# EAGLE design Wireless Flex Node SMD (EAGLE 7.5.0)
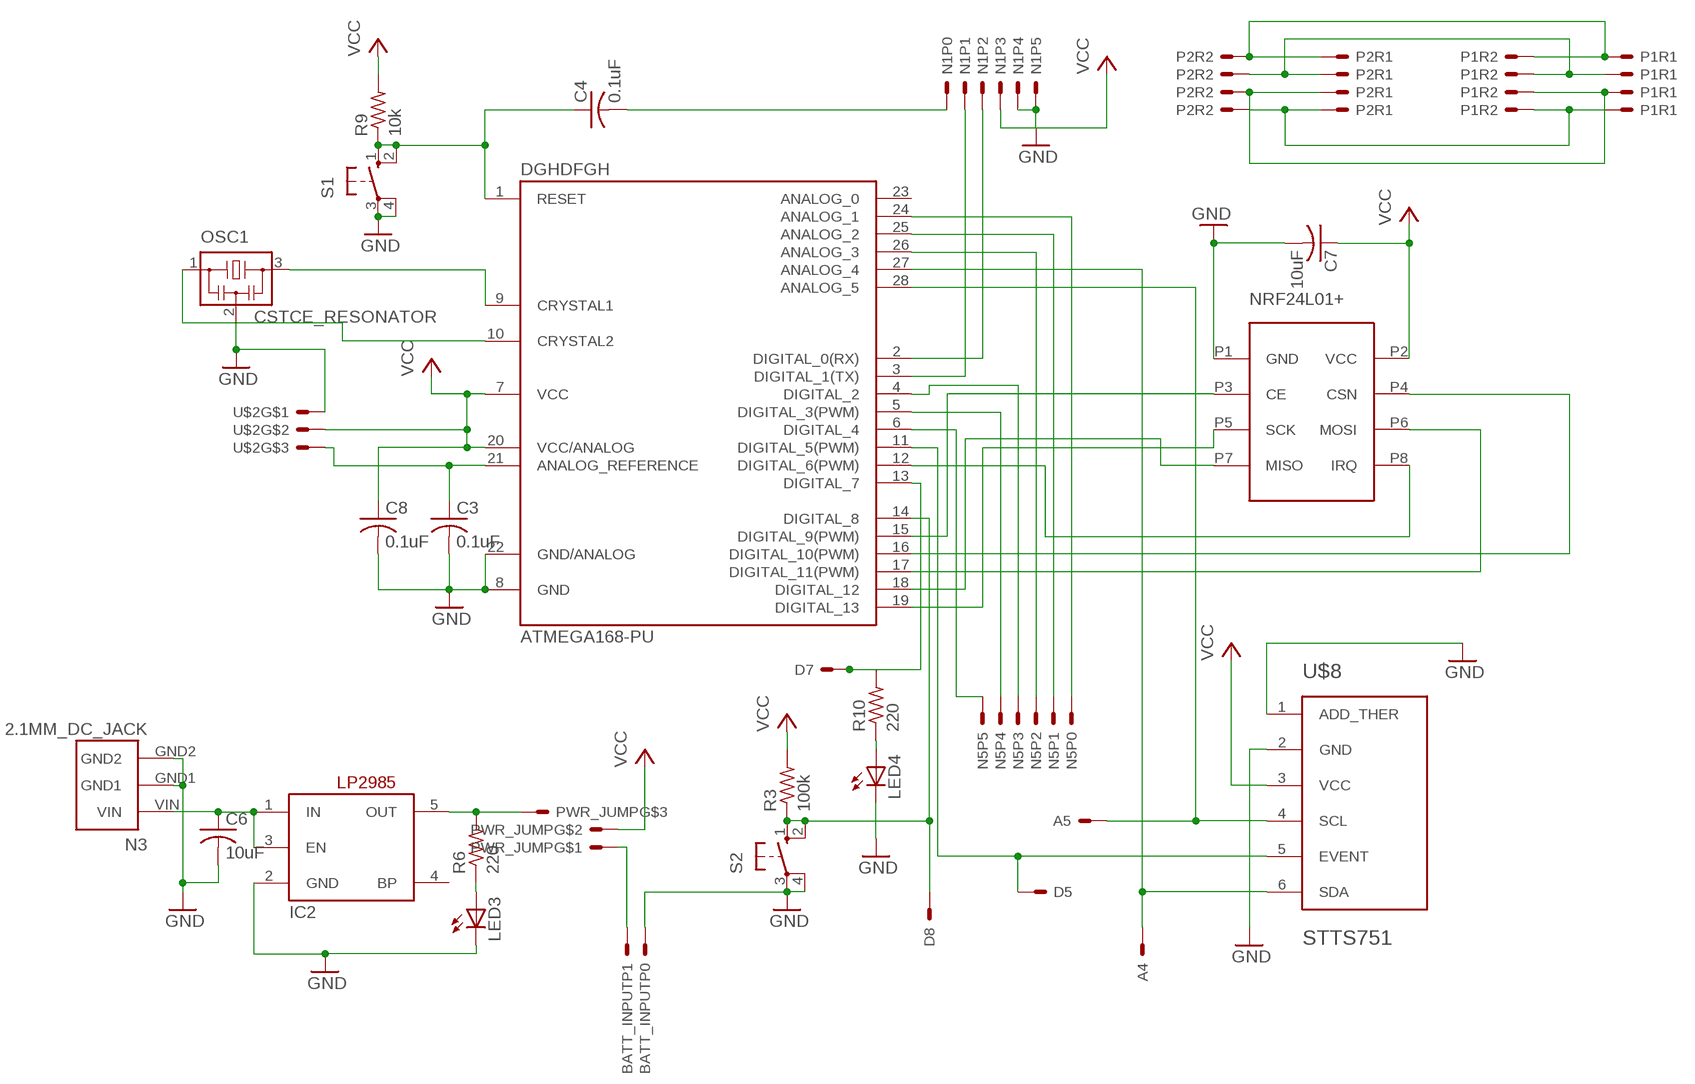
[diagram p0: schematic, sheet 1]

## Parts
A4  1PINHEADER_S  [1PINHEADER_S]
A5  1PINHEADER_S  [1PINHEADER_S]
BATT_INPUT  2PINHEADER  [2PINHEADER]
C3  0.1uF  C-USC1206  [C1206]
C4  0.1uF  C-USC1206  [C1206]
C6  10uF  C-USC1206  [C1206]
C7  10uF  C-USC1206  [C1206]
C8  0.1uF  C-USC1206  [C1206]
D5  1PINHEADER_S  [1PINHEADER_S]
D7  1PINHEADER_S  [1PINHEADER_S]
D8  1PINHEADER_S  [1PINHEADER_S]
DGHDFGH  ATMEGA168-PU  [DIL28-3]
IC2  LP2985  [SOT23]
LED3  LEDSMT1206  [1206]
LED4  LEDSMT1206  [1206]
N1  6PINHEADER  [6PINHEADER]
N3  2.1MM_DC_JACK  [2.1MM_DC_JACK]
N5  6PINHEADER  [6PINHEADER]
NRF24L01+  NRF24L01A  [NRF24L01]
OSC1  CSTCE_RESONATOR  [CSTCE_RESONATOR]
P1  2X4_HEADER  [2X4_HEADER]
P2  2X4_HEADER  [2X4_HEADER]
PWR_JUMP  3PINHEADER  [3PINHEADER]
R3  100k  R-US_R1206  [R1206]
R6  220  R-US_R1206  [R1206]
R9  10k  R-US_R1206  [R1206]
R10  220  R-US_R1206  [R1206]
S1  10-XX  [B3F-10XX]
S2  10-XX  [B3F-10XX]
U$2  3PINHEADER  [3PINHEADER]
U$8  STTS751  [STTS751-SOT23-6L]

## Nets
A5: D5.P$1(S) DGHDFGH.11(DIGITAL_5(PWM)) U$8.5(EVENT)
GND: BATT_INPUT.P0 C3.2 C6.2 C7.2 C8.2 DGHDFGH.8(GND) DGHDFGH.22(GND/ANALOG) IC2.2(GND) LED3.C LED4.C N1.P4 N1.P5 N3.GND1 N3.GND2 NRF24L01+.P1(GND) OSC1.2 S1.3(P) S1.4(P1) S2.3(P) S2.4(P1) U$2.N0 U$8.1(ADD_THER) U$8.2(GND)
N$1: DGHDFGH.10(CRYSTAL2) OSC1.1
N$2: DGHDFGH.18(DIGITAL_12) NRF24L01+.P7(MISO)
N$3: DGHDFGH.19(DIGITAL_13) NRF24L01+.P5(SCK)
N$5: DGHDFGH.17(DIGITAL_11(PWM)) NRF24L01+.P6(MOSI)
N$9: DGHDFGH.16(DIGITAL_10(PWM)) NRF24L01+.P4(CSN)
N$10: DGHDFGH.15(DIGITAL_9(PWM)) NRF24L01+.P3(CE)
N$11: D7.P$1(S) DGHDFGH.13(DIGITAL_7) R10.2
N$12: C4.2 N1.P0
N$13: DGHDFGH.9(CRYSTAL1) OSC1.3
N$15: C4.1 DGHDFGH.1(RESET) R9.1 S1.1(S) S1.2(S1)
N$16: D8.P$1(S) DGHDFGH.14(DIGITAL_8) R3.1 S2.1(S) S2.2(S1)
N$17: LED4.A R10.1
N$19: DGHDFGH.3(DIGITAL_1(TX)) N1.P1
N$20: DGHDFGH.2(DIGITAL_0(RX)) N1.P2
N$21: C3.1 DGHDFGH.21(ANALOG_REFERENCE) U$2.N2
N$22: DGHDFGH.12(DIGITAL_6(PWM)) NRF24L01+.P8(IRQ)
N$23: DGHDFGH.6(DIGITAL_4) N5.P5
N$25: DGHDFGH.5(DIGITAL_3(PWM)) N5.P4
N$26: A5.P$1(S) DGHDFGH.28(ANALOG_5) U$8.4(SCL)
N$28: A4.P$1(S) DGHDFGH.27(ANALOG_4) U$8.6(SDA)
N$32: C6.1 IC2.1(IN) IC2.3(EN) N3.VIN
N$34: IC2.5(OUT) PWR_JUMP.N2 R6.2
N$35: BATT_INPUT.P1 PWR_JUMP.N0
N$36: LED3.A R6.1
N$37: DGHDFGH.4(DIGITAL_2) N5.P3
N$38: DGHDFGH.26(ANALOG_3) N5.P2
N$39: DGHDFGH.25(ANALOG_2) N5.P1
N$40: DGHDFGH.24(ANALOG_1) N5.P0
N$88: P1.P1(R1:S) P1.P5(R2:S) P2.P1(R1:S) P2.P5(R2:S)
N$89: P1.P2(R1:S1) P1.P6(R2:S1) P2.P2(R1:S1) P2.P6(R2:S1)
N$90: P1.P3(R1:S2) P1.P7(R2:S2) P2.P3(R1:S2) P2.P7(R2:S2)
N$91: P1.P4(R1:S3) P1.P8(R2:S3) P2.P4(R1:S3) P2.P8(R2:S3)
VCC: C7.1 C8.1 DGHDFGH.7(VCC) DGHDFGH.20(VCC/ANALOG) N1.P3 NRF24L01+.P2(VCC) PWR_JUMP.N1 R3.2 R9.2 U$2.N1 U$8.3(VCC)
Unconnected: DGHDFGH.23(ANALOG_0) IC2.4(BP)

## Library data of the parts
A4 A5 D5 D7 D8 = ForceTronics:1PINHEADER_S: 1 pin header with round pad
BATT_INPUT = ForceTronics:2PINHEADER
C3 C4 C6-C8 = rcl:C-US: CAPACITOR, American symbol
DGHDFGH = Arduino-AVR:ATMEGA168-PU
IC2 = ForceTronics:LP2985: LP2985 Linear regulator from TI. Comes in various voltage levels. Low dropout and max current is 150mA
LED3 LED4 = adafruit:LED: LED OSRAM: - CHIPLED LG R971, LG N971, LY N971, LG Q971, LY Q971, LO R971, LY R971 LH N974, LH R974 LS Q976, LO Q976, LY Q976 LO Q996 - Hyper CHIPLED LW Q18S LB Q993, LB Q99A, LB R99A - SideLED LS A670, LO A670, LY A670, LG A670, LP A670 LB A673, LV A673, LT A673, LW A673 LH A674 LY A675 LS A676, LA A676, LO A676, LY A676, LW A676 LS A679, LY A679, LG A679 - Hyper Micro SIDELEDÂ® LS Y876, LA Y876, LO Y876, LY Y876 LT Y87S - SmartLED LW L88C, LW L88S LB L89C, LB L89S, LG L890 LS L89K, LO L89K, LY L89K LS L896, LA L896, LO L896, LY L896 - TOPLED LS T670, LO T670, LY T670, LG T670, LP T670 LSG T670, LSP T670, LSY T670, LOP T670, LYG T670 LG T671, LOG T671, LSG T671 LB T673, LV T673, LT T673, LW T673 LH T674 LS T676, LA T676, LO T676, LY T676, LB T676, LH T676, LSB T676, LW T676 LB T67C, LV T67C, LT T67C, LS T67K, LO T67K, LY T67K, LW E67C LS E67B, LA E67B, LO E67B, LY E67B, LB E67C, LV E67C, LT E67C LW T67C LS T679, LY T679, LG T679 LS T770, LO T770, LY T770, LG T770, LP T770 LB T773, LV T773, LT T773, LW T773 LH T774 LS E675, LA E675, LY E675, LS T675 LS T776, LA T776, LO T776, LY T776, LB T776 LHGB T686 LT T68C, LB T68C - Hyper Mini TOPLEDÂ® LB M676 - Mini TOPLED SantanaÂ® LG M470 LS M47K, LO M47K, LY M47K Source: http://www.osram.convergy.de/
N1 N5 = ForceTronics:6PINHEADER
N3 = ForceTronics:2.1MM_DC_JACK: Male DC Jack 2.1mm
NRF24L01+ = ForceTronics:NRF24L01
OSC1 = ForceTronics:CSTCE_RESONATOR: CSTCE8.000M 8MHz SMD resonator. Data sheet http://www.mouser.com/ds/2/281/p16e-522700.pdf
P1 P2 = ForceTronics:2X4_HEADER: 2 x 4 Female Pin Header, Spacing is .1"
PWR_JUMP U$2 = ForceTronics:3PINHEADER: 3 pin header with oval copper
R3 R6 R9 R10 = rcl:R-US_: RESISTOR, American symbol
S1 S2 = switch-omron:10-XX: OMRON SWITCH; MPN: B3F-1000; OC_FARNELL: 176432; OC_NEWARK: 36M3542
U$8 = ForceTronics:STTS751: STTS751 Temperature sensor with SOT23-6L package

## Board
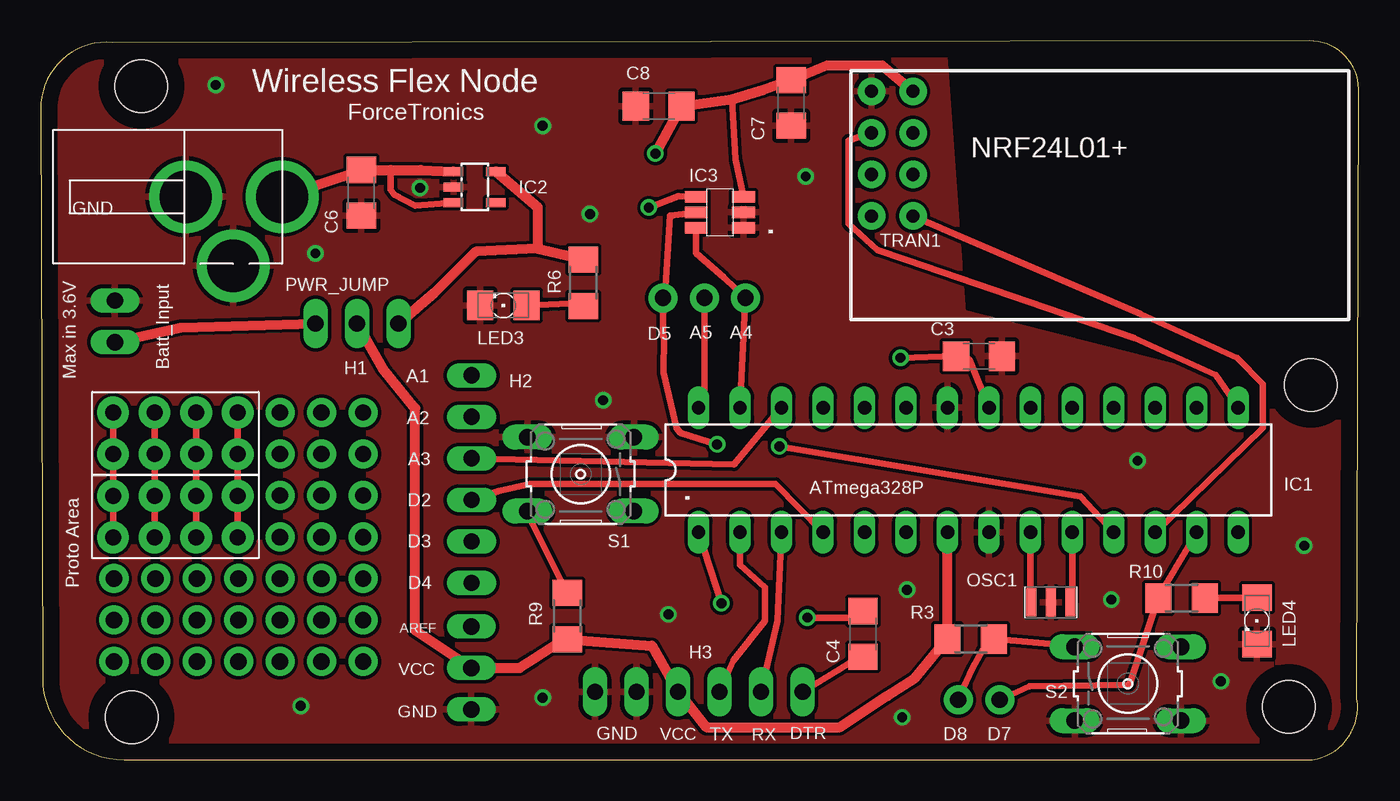
[diagram p1: board, top side]
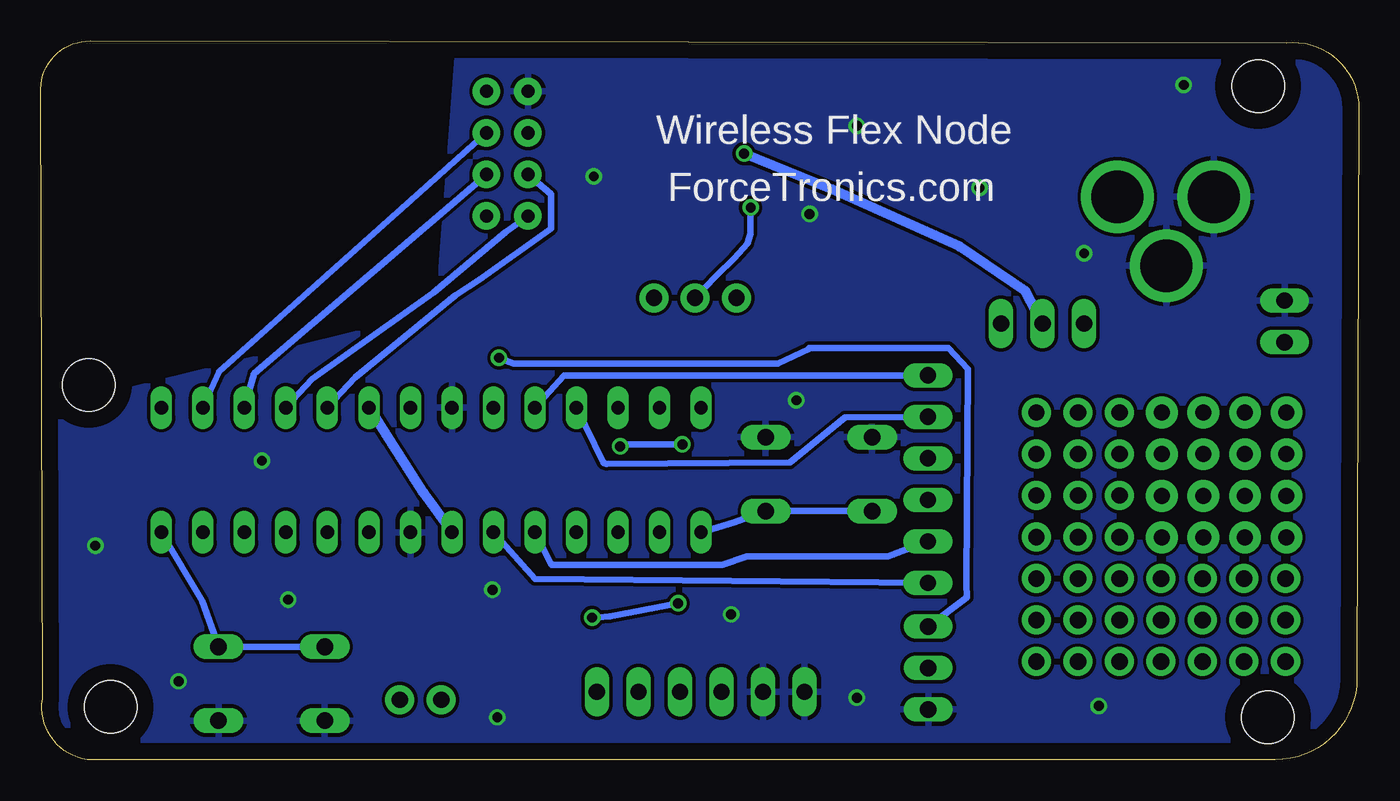
[diagram p2: board, bottom side, seen from below]

Size 80.63 x 44 mm. Coordinates in mm from the lower left corner, seen from the top.
Outline: 0,40.2 0.1,5 arc90 5.1,0 77.8,0 arc90 80.53,3.73 80.63,41.07 arc90 77.6,44 4.4,43.9 arc90 0,40.2
Copper layers (1*16): Top 0.035mm / dielectric 1.5mm / Bottom 0.035mm
Design rules "default": minimum track width 10mil, minimum drill 24mil, track to track 8mil, track to pad 8mil, pad to pad 8mil, via to via 8mil, smd to smd 8mil, copper to edge 40mil, drill to drill 8mil, minimum pad ring 10mil, minimum via ring 8mil, stop-mask expansion 4mil, vias tented up to drill 0mil, thermal gap 10mil
Holes 3.2 mm at 6.14,41.24 5.56,2.61 76.36,3.24 77.7,22.95

### Footprints (pad centres in the part's own frame; a part is rotated, then mirrored left to right if it is on the bottom)
1PINHEADER_S = drill 1 pad 1.778: P$1 1.27,1.27
2PINHEADER = drill 1 long: P0 -1.27,0; P1 1.27,0
C1206 = smd 1.6 x 1.8: 1 -1.4,0; 2 1.4,0
DIL28-3 = drill 0.813 long: 1 -16.51,-3.81; 2 -13.97,-3.81; 3 -11.43,-3.81; 4 -8.89,-3.81; 5 -6.35,-3.81; 6 -3.81,-3.81; 7 -1.27,-3.81; 8 1.27,-3.81; 9 3.81,-3.81; 10 6.35,-3.81; 11 8.89,-3.81; 12 11.43,-3.81; 13 13.97,-3.81; 14 16.51,-3.81; 15 16.51,3.81; 16 13.97,3.81; 17 11.43,3.81; 18 8.89,3.81; 19 6.35,3.81; 20 3.81,3.81; 21 1.27,3.81; 22 -1.27,3.81; 23 -3.81,3.81; 24 -6.35,3.81; 25 -8.89,3.81; 26 -11.43,3.81; 27 -13.97,3.81; 28 -16.51,3.81
SOT23 = smd 0.55 x 1.2: 1 1.59,1.24; 2 2.54,1.24; 3 3.49,1.24; 4 3.49,3.84; 5 1.59,3.84
1206 = smd 1.6 x 1.803: A -1.422,0; C 1.422,0
6PINHEADER = drill 1 long: P0 1.27,-1.778; P1 3.81,-1.778; P2 6.35,-1.778; P3 8.89,-1.778; P4 11.43,-1.778; P5 13.97,-1.778
2.1MM_DC_JACK = drill 3.2 pad 4.445: GND1 4.1,8.1; GND2 8.327,11; VIN 4.1,14
NRF24L01 = drill 0.8 pad 1.676: P1 13.97,-1.27; P2 13.97,-3.81; P3 11.43,-1.27; P4 11.43,-3.81; P5 8.89,-1.27; P6 8.89,-3.81; P7 6.35,-1.27; P8 6.35,-3.81
CSTCE_RESONATOR = smd 0.6 x 1.7: 1 -1.2,1.27; 2 0,1.27; 3 1.2,1.27
2X4_HEADER = drill 1 pad 1.93: P1 1.27,3.81; P2 3.81,3.81; P3 6.35,3.81; P4 8.89,3.81; P5 1.27,1.27; P6 3.81,1.27; P7 6.35,1.27; P8 8.89,1.27
3PINHEADER = drill 1 long: N0 1.27,1.27; N1 3.81,1.27; N2 6.35,1.27
R1206 = smd 1.6 x 1.803: 1 -1.422,0; 2 1.422,0
B3F-10XX = drill 1.016 long: 1 -3.251,2.261; 2 3.251,2.261; 3 -3.251,-2.261; 4 3.251,-2.261
STTS751-SOT23-6L = smd 1.4 x 0.7: 1 -0.65,2.4; 2 -0.65,1.45; 3 -0.65,0.5; 4 2.25,0.5; 5 2.25,1.45; 6 2.25,2.4

### Placement (x,y rotation side)
A4  41.84,27 0 top
A5  39.34,27 0 top
BATT_INPUT  4.52,26.83 270 top
C3  57.4,24.7 0 top
C4  50.3,7.7 270 top
C6  19.6,34.7 270 top
C7  45.9,40.2 270 top
C8  37.8,40 180 top
D5  36.8,27 0 top
D7  57.4,2.4 0 top
D8  54.86,2.4 0 top
DGHDFGH  56.75,17.74 0 top
IC2  24,37.6 270 top
LED3  28.3,27.8 180 top
LED4  74.4,8.5 270 top
N1  47.87,2.38 180 top
N3  0.76,38.56 270 top
N5  28.14,24.8 270 top
NRF24L01+  49.56,26.94 90 top
OSC1  61.8,10.9 180 top
P1  3.15,17.44 0 top
P2  3.15,12.34 0 top
PWR_JUMP  15.53,25.43 0 top
R3  56.9,7.4 180 top
R6  33.2,29.2 90 top
R9  32.2,8.8 270 top
R10  69.8,9.9 180 top
S1  33.03,17.48 180 top
S2  66.51,4.65 0 top
U$2  27.6,1.8 90 top
U$8  42.35,34.96 180 top

### Tracks (layer width: path | path; a pad name or v marks a point on that pad's centre or on a via)
A5  (via drill 0.6)
  Top 0.406: v41.38,19.3 39.14,20.02 38.9,20.32 38.1,23.7 38.13,25.9 38.07,25.9 D5.P$1 38.2,28.47 38.5,33.3 U$8.5 | v45.19,19.18 63.61,16.13 DGHDFGH.11
  Bottom 0.406: v41.38,19.3 45.19,19.3 v45.19,19.18
GND  (via drill 0.6)
  other vias: 23.2,35 46.8,35.7 10.7,41.3 67.1,18.3 72.2,4.8 65.5,9.8 53,10.4 38.4,8.9 30.7,3.8 15.9,3.3 16.8,31 30.7,38.8 77.3,13.1 33.6,33.4 34.4,22 52.7,2.6
  pour Bottom: 79.1,-1 6.1,-1 arc-90 0.1,5 0.1,45 arc-90 5.1,50 54.6,49.9 56.32,27.32 84.2,20.4 85.1,5 arc-90
  pour Top: 84,20.3 85.1,0.92 arc-90 80.1,-1.54 5.1,0 arc-90 0.1,5 0.1,45 arc-90 5.1,50 54.8,49.9 56.42,27.37
GND1  (via drill 1 pad 1.78)
  other vias: 4.47,8.55
GND2  (via drill 1 pad 1.78)
  other vias: 4.47,6.01
N$1
  Top 0.406: DGHDFGH.10 63.1,9.73 63,9.73 OSC1.1
N$2
  Bottom 0.406: NRF24L01+.P7 52.2,32.29 56.6,28.6 64.04,23.3 DGHDFGH.18
N$3
  Bottom 0.406: NRF24L01+.P5 49.4,34.63 49.4,32.5 53.8,29.4 55.3,28.4 61.4,23.4 DGHDFGH.19
N$5
  Bottom 0.406: NRF24L01+.P6 67.58,23.63 DGHDFGH.17
N$9
  Bottom 0.406: NRF24L01+.P4 69.72,23.77 DGHDFGH.16
N$10
  Top 0.406: DGHDFGH.15 71.9,23.55 66.9,25.8 52.9,30.6 51.2,31.2 49.4,32.8 49.4,37 49.43,37.9 NRF24L01+.P3
N$11
  Top 0.406: DGHDFGH.13 68.92,10.9 R10.2 66.6,4.6 60.47,4.5 D7.P$1
N$12
  Top 0.406: N1.P0 48.87,5.55 50.3,6.45 C4.2
N$13
  Top 0.406: DGHDFGH.9 60.56,9.73 60.6,9.73 OSC1.3
N$15  (via drill 0.6)
  Top 0.406: v41.64,9.58 DGHDFGH.1 | S1.2 30.1,14.42 R9.1 | v46.9,8.7 50.3,8.7 C4.1
  Bottom 0.406: DGHDFGH.1 38.23,14.54 S1.1 S1.2 | v41.64,9.58 45.8,8.78 v46.9,8.7
N$16
  Top 0.406: S2.1 62.76,7 R3.1 57.62,6.7 57,5.6 56.1,3.67 D8.P$1
  Bottom 0.406: DGHDFGH.14 70.76,9.71 S2.2 S2.1
N$17
  Top 0.406: R10.1 74.4,9.9 LED4.A
N$19
  Top 0.406: N1.P1 45.07,8.5 DGHDFGH.3
N$20
  Top 0.406: N1.P2 42.39,6.09 42.39,6.1 44.3,8.51 44.3,10.54 42.78,11.94 DGHDFGH.2
N$21  (via drill 0.6)
  Top 0.406: v52.6,24.6 C3.1 56.82,24.5 DGHDFGH.21
  Bottom 0.406: U$2.N2 23.98,9.95 24,10.75 23.9,23.9 25.1,25.2 33.63,25.2 33.63,25.15 35.53,24.26 51.7,24.26 v52.6,24.6
N$22
  Top 0.406: DGHDFGH.12 70.36,16.03 74.78,20.32 74.78,23 73.2,24.6 67.3,27.29 NRF24L01+.P8
N$23
  Bottom 0.406: N5.P5 50.4,11.08 DGHDFGH.6
N$25
  Bottom 0.406: N5.P4 27.02,13.11 28.8,12.45 37.44,12.45 38.96,11.94 49.38,11.94 DGHDFGH.5
N$26  (via drill 0.6)
  Top 0.406: v37.2,33.8 39,34.5 U$8.4 | DGHDFGH.28 40.61,21.55 A5.P$1
  Bottom 0.406: v37.2,33.8 37.2,32.2 37.4,31.6 38.2,30.7 39.31,29.6 A5.P$1
N$28
  Top 0.406: U$8.6 40.1,31 41.81,29.5 A4.P$1 43.08,27.77 DGHDFGH.27
N$32
  Top 0.406: IC2.3 22.9,33.91 21.6,34.6 21.4,34.9 21.4,36.1
  Top 0.61: N3.VIN 19.6,36.06 C6.1 21.4,36.1 23.24,36.1 IC2.1
N$34
  Top 0.61: PWR_JUMP.N2 24.1,28.6 26.6,31.1 30.4,31.3 | IC2.5 30.4,33.81 30.4,31.3 | 30.4,31.3 32.9,30.7 R6.2
N$35
  Top 0.61: BATT_INPUT.P1 8.55,26.44 PWR_JUMP.N0
N$36
  Top 0.406: R6.1 33.72,27.98 LED3.A
N$37
  Top 0.406: N5.P3 28.04,16.46 29.95,16.89 44.94,16.89 DGHDFGH.4
N$38
  Top 0.406: N5.P2 42.4,18.07 DGHDFGH.26
N$39
  Bottom 0.406: DGHDFGH.25 46.21,18.16 46.01,18.11 34.8,18.19 31.44,20.96 N5.P1
N$40
  Bottom 0.406: N5.P0 48.62,23.53 DGHDFGH.24
N$45  (via drill 1 pad 1.78)
  other vias: 14.63,21.25
N$46  (via drill 1 pad 1.78)
  other vias: 17.17,21.25
N$47  (via drill 1 pad 1.78)
  other vias: 19.71,21.25
N$52  (via drill 1 pad 1.78)
  other vias: 14.63,18.71
N$53  (via drill 1 pad 1.78)
  other vias: 17.17,18.71
N$54  (via drill 1 pad 1.78)
  other vias: 19.71,18.71
N$59  (via drill 1 pad 1.78)
  other vias: 14.63,16.17
N$60  (via drill 1 pad 1.78)
  other vias: 17.17,16.17
N$61  (via drill 1 pad 1.78)
  other vias: 19.71,16.17
N$62  (via drill 1 pad 1.78)
  other vias: 19.71,13.63
N$63  (via drill 1 pad 1.78)
  other vias: 17.17,13.63
N$64  (via drill 1 pad 1.78)
  other vias: 14.63,13.63
N$69  (via drill 1 pad 1.78)
  other vias: 4.47,11.09
N$70  (via drill 1 pad 1.78)
  other vias: 7.01,11.09
N$71  (via drill 1 pad 1.78)
  other vias: 9.55,11.09
N$72  (via drill 1 pad 1.78)
  other vias: 12.09,11.09
N$73  (via drill 1 pad 1.78)
  other vias: 14.63,11.09
N$74  (via drill 1 pad 1.78)
  other vias: 17.17,11.09
N$75  (via drill 1 pad 1.78)
  other vias: 19.71,11.09
N$76  (via drill 1 pad 1.78)
  other vias: 19.71,8.55
N$77  (via drill 1 pad 1.78)
  other vias: 17.17,8.55
N$78  (via drill 1 pad 1.78)
  other vias: 14.63,8.55
N$79  (via drill 1 pad 1.78)
  other vias: 12.09,8.55
N$80  (via drill 1 pad 1.78)
  other vias: 9.55,8.55
N$81  (via drill 1 pad 1.78)
  other vias: 7.01,8.55
N$82  (via drill 1 pad 1.78)
  other vias: 19.71,6.01
N$83  (via drill 1 pad 1.78)
  other vias: 17.17,6.01
N$84  (via drill 1 pad 1.78)
  other vias: 14.63,6.01
N$85  (via drill 1 pad 1.78)
  other vias: 12.09,6.01
N$86  (via drill 1 pad 1.78)
  other vias: 9.55,6.01
N$87  (via drill 1 pad 1.78)
  other vias: 7.01,6.01
N$88
  Top 0.406: P1.P1 P1.P5 P2.P1 P2.P5
N$89
  Top 0.406: P1.P2 P1.P6 P2.P2 P2.P6
N$90
  Top 0.406: P1.P3 P1.P7 P2.P3 P2.P7
N$91
  Top 0.406: P1.P4 P1.P8 P2.P4 P2.P8
VCC  (via drill 0.6)
  Top 0.406: U$8.3 42.5,36.76 42.3,40.41
  Top 0.61: v37.6,37.1 C8.1 42.3,40.41 44.2,41 C7.1 48.1,42.5 51.47,42.5 NRF24L01+.P2 | PWR_JUMP.N1 20.94,23.9 22.9,21.5 22.9,7.92 U$2.N1 29.3,5.62 30.2,6.2 32.2,7.5 R9.2 37.38,6.98 N1.P3 39.7,3.26 40.7,2 48.9,2 51.8,3.9 53.48,5 R3.2 55.48,7 DGHDFGH.7
  Bottom 0.61: DGHDFGH.20 59.29,19.56 57.23,16.37 56.7,15.63 DGHDFGH.7 | PWR_JUMP.N1 20.4,28.7 24.4,31.4 32.2,34.9 v37.6,37.1

### Text on the board
tNames: Wireless Flex Node | ForceTronics | IC3 | GND | . | TRAN1 | Max in 3.6V | Batt_Input | A5 | A4 | D5 | H1 | H2 | A1 | A2 | A3 | IC1 | Proto Area | . | ATmega328P | D2 | D3 | D4 | AREF | H3 | VCC | GND | D8 | D7 | GND | VCC | TX | RX | DTR
bNames: Wireless Flex Node | ForceTronics.com